# Altium schematic sheet Sch_Profe_DIIN.SchDoc
size A; SheetNumber: 1; SheetTotal: 1
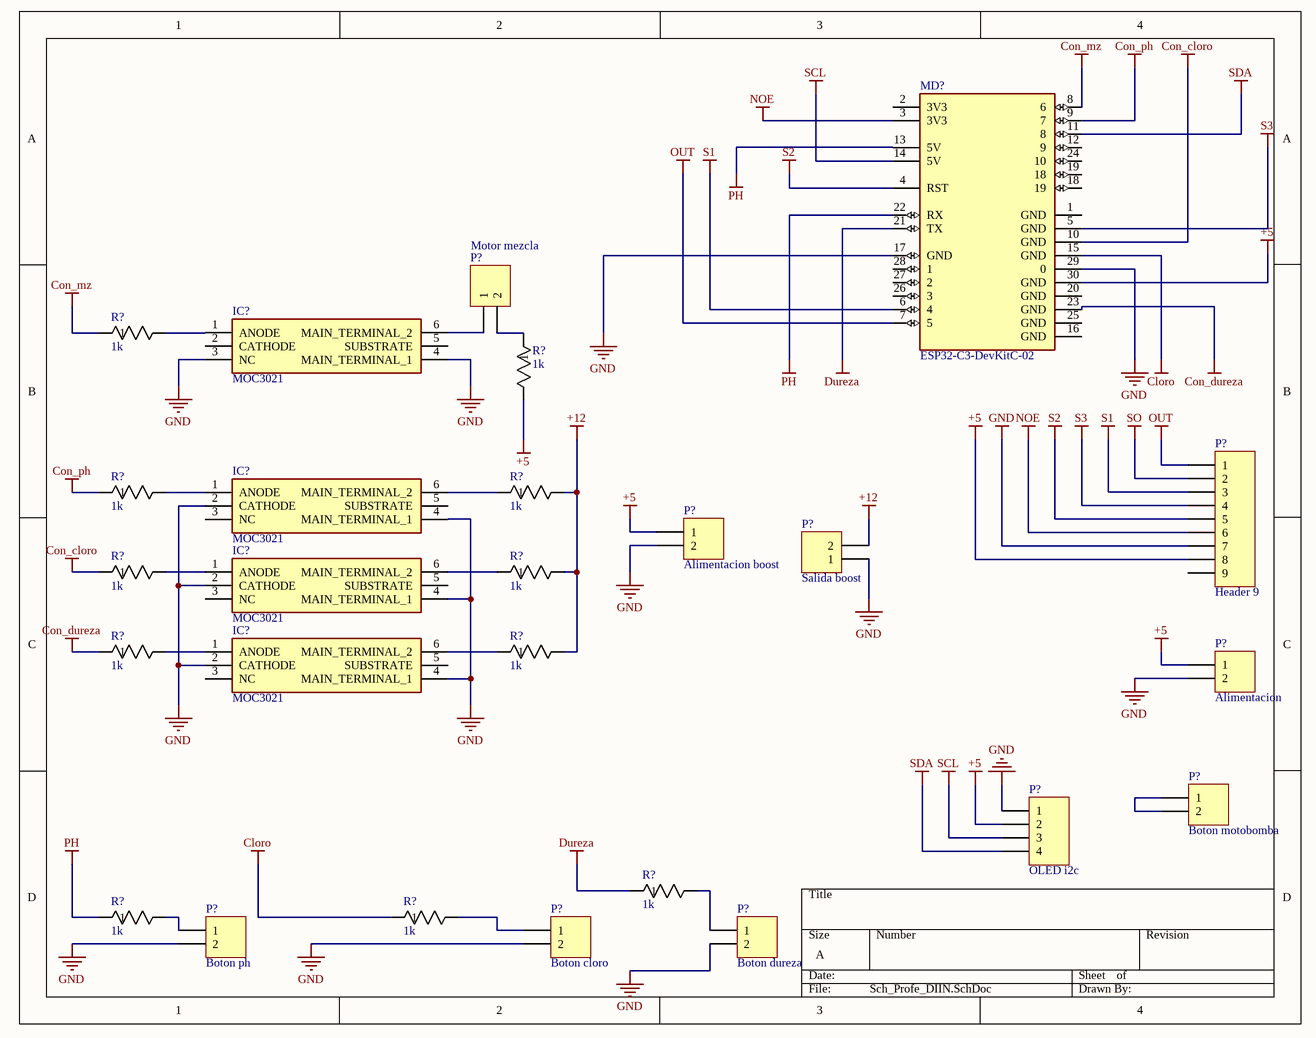
[diagram p0: Sch_Profe_DIIN.SchDoc]

## Parts
(Parts that share a designator on the sheet are numbered #1, #2 ... from top to bottom, then left to right.)
IC?#1  MOC3021  [DIP762W60P254L730H450Q6N]
IC?#2  MOC3021  [DIP762W60P254L730H450Q6N]
IC?#3  MOC3021  [DIP762W60P254L730H450Q6N]
IC?#4  MOC3021  [DIP762W60P254L730H450Q6N]
MD?  ESP32-C3-DevKitC-02  [FP-ESP32-C3-DevKitC-02-MFG]
P?#1  Motor mezcla  [HDR1X2]
P?#2  Header 9  [HDR1X9]
P?#3  Alimentacion boost  [HDR1X2]
P?#4  Salida boost  [HDR1X2]
P?#5  Alimentacion  [HDR1X2]
P?#6  Boton motobomba  [HDR1X2]
P?#7  OLED i2c  [HDR1X4]
P?#8  Boton ph  [HDR1X2]
P?#9  Boton cloro  [HDR1X2]
P?#10  Boton dureza  [HDR1X2]
R?#1  1k  [RES_AC03_VIS]
R?#2  1k  [RES_AC03_VIS]
R?#3  1k  [RES_AC03_VIS]
R?#4  1k  [RES_AC03_VIS]
R?#5  1k  [RES_AC03_VIS]
R?#6  1k  [RES_AC03_VIS]
R?#7  1k  [RES_AC03_VIS]
R?#8  1k  [RES_AC03_VIS]
R?#9  1k  [RES_AC03_VIS]
R?#10  1k  [RES_AC03_VIS]
R?#11  1k  [RES_AC03_VIS]

## Nets
+5: MD?.30(GND) P?#2.8 P?#3.1 P?#5.1 P?#7.2 R?#2.2
+12: P?#4.2 R?#4.2 R?#6.2 R?#8.2
Cloro: MD?.15(GND) R?#11.1
Con_cloro: MD?.10(GND) R?#5.1
Con_dureza: MD?.23(GND) R?#7.1
Con_mz: MD?.8(6) R?#1.1
Con_ph: MD?.9(7) R?#3.1
Dureza: MD?.21(TX) R?#9.1
GND: IC?#1.3(NC) IC?#1.4(MAIN_TERMINAL_1) IC?#2.2(CATHODE) IC?#2.4(MAIN_TERMINAL_1) IC?#3.2(CATHODE) IC?#3.4(MAIN_TERMINAL_1) IC?#4.2(CATHODE) IC?#4.4(MAIN_TERMINAL_1) MD?.17(GND) MD?.29(0) P?#2.7 P?#3.2 P?#4.1 P?#5.2 P?#7.1 P?#8.2 P?#9.2 P?#10.2
NOE: MD?.3(3V3) P?#2.6
OUT: MD?.7(5) P?#2.1
PH: MD?.13(5V) MD?.22(RX) R?#10.1
S1: MD?.6(4) P?#2.3
S2: MD?.4(RST) P?#2.5
S3: MD?.5(GND) P?#2.4
SCL: MD?.14(5V) P?#7.3
SDA: MD?.11(8) P?#7.4
SO: P?#2.2
NetIC?#1_1: IC?#1.1(ANODE) R?#1.2
NetIC?#1_6: IC?#1.6(MAIN_TERMINAL_2) P?#1.1
NetIC?#2_1: IC?#2.1(ANODE) R?#3.2
NetIC?#2_6: IC?#2.6(MAIN_TERMINAL_2) R?#4.1
NetIC?#3_1: IC?#3.1(ANODE) R?#5.2
NetIC?#3_6: IC?#3.6(MAIN_TERMINAL_2) R?#6.1
NetIC?#4_1: IC?#4.1(ANODE) R?#7.2
NetIC?#4_6: IC?#4.6(MAIN_TERMINAL_2) R?#8.1
NetP?#1_2: P?#1.2 R?#2.1
NetP?#6_1: P?#6.1 P?#6.2
NetP?#8_1: P?#8.1 R?#10.2
NetP?#9_1: P?#9.1 R?#11.2
NetP?#10_1: P?#10.1 R?#9.2

Not connected (* = marked no-connect by the designer): IC?#1 2(CATHODE) 5(SUBSTRATE); IC?#2 3(NC) 5(SUBSTRATE); IC?#3 3(NC) 5(SUBSTRATE); IC?#4 3(NC) 5(SUBSTRATE); MD? 1(GND) 2(3V3) 12(9) 16(GND) 18(19) 19(18) 20(GND) 24(10) 25(GND) 26(3) 27(2) 28(1); P?#2 9

## Library data of the parts
IC?#1-IC?#4 = MOC3021: Integrated Circuit; Manufacturer_Name: Lite-On; Datasheet Link: https://datasheet.datasheetarchive.com/originals/distributors/Datasheets-17/DSA-323139.pdf; Height: 4.5mm; Manufacturer_Part_Number: MOC3021; Mouser Part Number: 859-MOC3021; Mouser Price/Stock: https://www.mouser.co.uk/ProductDetail/Lite-On/MOC3021?qs=%2F3Qg3%252BjSQfNbQyAt8MJ%2FPw%3D%3D; Arrow Part Number: MOC3021; Arrow Price/Stock: https://www.arrow.com/en/products/moc3021/lite-on-technology?region=nac
MD? = CMP-194061-000001-1: ESP32-C3-WROOM-02 DEV BRD
P?#1 P?#3-P?#6 P?#8-P?#10 = Header 2: Header, 2-Pin; LatestRevisionDate: 17-Jul-2002; LatestRevisionNote: Re-released for DXP Platform.; Publisher: Altium Limited
P?#2 = Header 9: Header, 9-Pin; LatestRevisionDate: 17-Jul-2002; LatestRevisionNote: Re-released for DXP Platform.; Publisher: Altium Limited
P?#7 = Header 4: Header, 4-Pin; LatestRevisionDate: 17-Jul-2002; LatestRevisionNote: Re-released for DXP Platform.; Publisher: Altium Limited
R?#1-R?#11 = CMP-00030-41941222-1: AC03000001008JAC00 VISHAY AC03000001008JAC00 Through Hole Resistor, 1 ohm, Axial Leaded, 3 W, 5%, AC Series; Voltage Rating: 2V; Max Power Dissipation: 3W; Resistance: 1Ω; Temperature Coefficient: -10ppm/°C; Lead Diameter: 800µm; Schedule B: 8533210080, 8533210080; Packaging: Cut Tape (CT); RoHS: Compliant; Weight: 749.986634mg; Case/Package: Conformal; Lead Free: Lead Free; Composition: Metal Film, Wirewound; Width: 4.8mm; Diameter: 4.8mm; Length: 13mm; Max Operating Temperature: 275°C; Number of Pins: 2; Tolerance: 5%; Features: Flame Retardant Coating; Contact Plating: Tin; Min Operating Temperature: 0°C; Mount: Through Hole; Termination: Axial; Power Rating: 3W; REACH SVHC: Unknown; Voltage Rating (DC): 2V; Number of Terminations: 2; Military Standard: Not; NexarPartId: 41941222; Radiation Hardening: No